# Altium schematic sheet USB_FE1.1.SchDoc
size A4; SheetNumber: 2; SheetTotal: 2
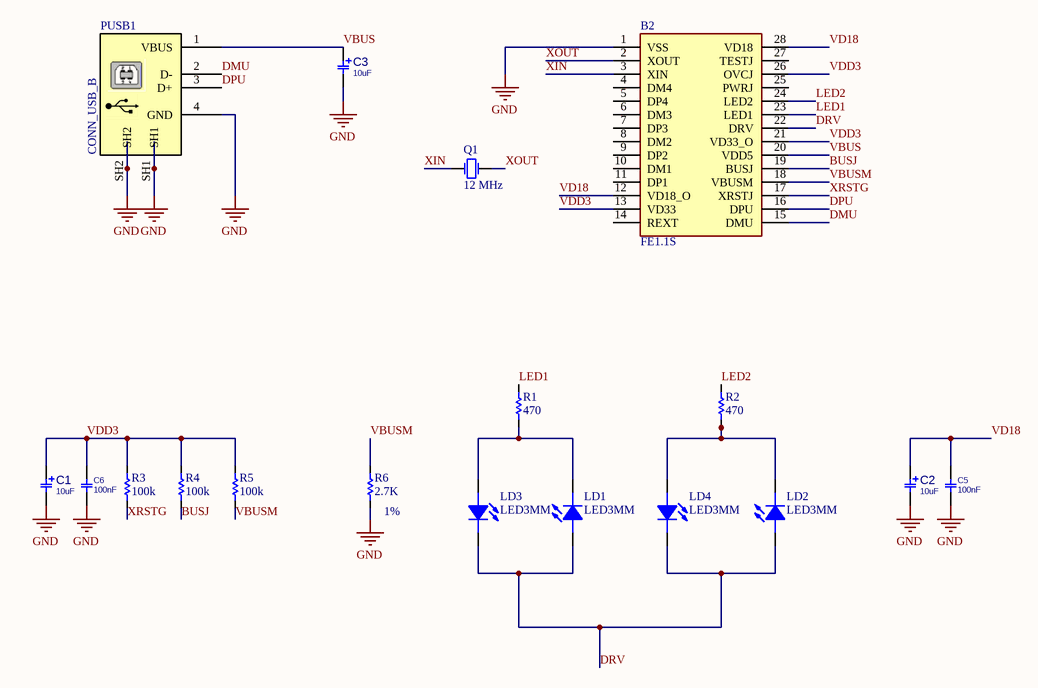
[diagram p0: USB_FE1.1.SchDoc]

## Parts
B2  FE1.1S  [SOP64P600X175-28N]
C1  10uF  [C_EL_4X7]
C2  10uF  [C_EL_4X7]
C3  10uF  [C_EL_4X7]
C5  100nF  [C_CER_D3]
C6  100nF  [C_CER_D3]
LD1  LED3MM  [LED3mm_GRN]
LD2  LED3MM  [LED3mm_GRN]
LD3  LED3MM  [LED3mm_GRN]
LD4  LED3MM  [LED3mm_GRN]
PUSB1  CONN_USB_B  [USB_B_RA_THD]
Q1  12 MHz  [XTAL 16MHZ]
R1  470  [Res-(1/4)]
R2  470  [Res-(1/4)]
R3  100k  [Res-(1/4)]
R4  100k  [Res-(1/4)]
R5  100k  [Res-(1/4)]
R6  Tolerance: 1%  [Res-(1/4)]  (hidden comment: 2.7K)

## Nets
GND: B2.1(VSS) C1.2 C2.2 C3.2 C5.1 C6.1 PUSB1.4(GND) PUSB1.SH1 PUSB1.SH2 R6.1
BUSJ: B2.19(BUSJ) R4.1
DMU: B2.15(DMU) PUSB1.2(D-)
DPU: B2.16(DPU) PUSB1.3(D+)
DRV: B2.22(DRV) LD1.1(ANODE) LD2.1(ANODE) LD3.2(CATHODE) LD4.2(CATHODE)
LED1: B2.23(LED1) R1.2
LED2: B2.24(LED2) R2.2
VBUS: B2.20(VDD5) C3.1 PUSB1.1(VBUS)
VBUSM: B2.18(VBUSM) R5.1 R6.2
VD18: B2.12(VD18_O) B2.28(VD18) C2.1 C5.2
VDD3: B2.13(VD33) B2.21(VD33_O) B2.26(OVCJ) C1.1 C6.2 R3.2 R4.2 R5.2
XIN: B2.3(XIN) Q1.1(OSC1)
XOUT: B2.2(XOUT) Q1.2(OSC2)
XRSTG: B2.17(XRSTJ) R3.1
NetLD1_2: LD1.2(CATHODE) LD3.1(ANODE) R1.1
NetLD2_2: LD2.2(CATHODE) LD4.1(ANODE) R2.1

Not connected (* = marked no-connect by the designer): B2 4(DM4) 5(DP4) 6(DM3) 7(DP3) 8(DM2) 9(DP2) 10(DM1) 11(DP1) 14(REXT) 25(PWRJ) 27(TESTJ)

## Library data of the parts
B2 = FE1.1S: USB 2.0 HIGH SPEED 4-PORT HUB CONTROLLER; Manufacturer_Name: JFD IC; Geometry.Height: 1.75mm; Manufacturer_Part_Number: FE1.1S; Mouser Part Number: *; Mouser Price/Stock: *; Arrow Part Number: *; Arrow Price/Stock: *; Datasheet Link: https://cdn-shop.adafruit.com/product-files/2991/FE1.1s+Data+Sheet+(Rev.+1.0).pdf
C1-C3 = CAP_THD_EL: CAP, THD, ELEC,; MANF_P#: MANF_PART#; PARAM2: 20%; DESC: DESCRIPTION; DIST#: MOUSER; PARAM: 25V; PRICE: 10= 5$; MANF: MANF; ASSEMBLY: ASSEMBLY; VALUE: 10uF
C5 C6 = CAP_THD_CERML: CAP, THD, CER MULTI LAYER,; PARAM: 50V; DESC: CAP, CER MULTI LAYER,; MANF_P#: MANF_PART#; PRICE: 100= 1$; MANF: MANF; PARAM2: PARAM2; ASSEMBLY: ASSEMBLY; VALUE: 100nF
LD1-LD4 = LED 3MM: Light Emitting Diode; Designer: Ali Hafizi
PUSB1 = CONN_USB_B_RA_THD: CONN, USB, B, R/A, THD; MANF_P#: 292304-1; MANF: TE Connectivity; VALUE: CONN_USB_B
Q1 = XTAL: XTAL Crystal; Designer: ABBAS BASEREH; Design Date: 2017-1-3; ComponentLink1Description: Datasheet; ComponentLink2Description: Reference; Mounting Technology: Surface Mount\Through-Hole; Value: 12 MHz; Status: Unreleased
R1-R5 = Resistor: Tolerance: 5%; Power: 1/4 W
  R1 R2: Value: 470
  R3-R5: Value: 100k
R6 = Resistor: Power: 1/4 W; Value: 2.7K